# EAGLE schematic PCB_Vienna (EAGLE 9.5.1)
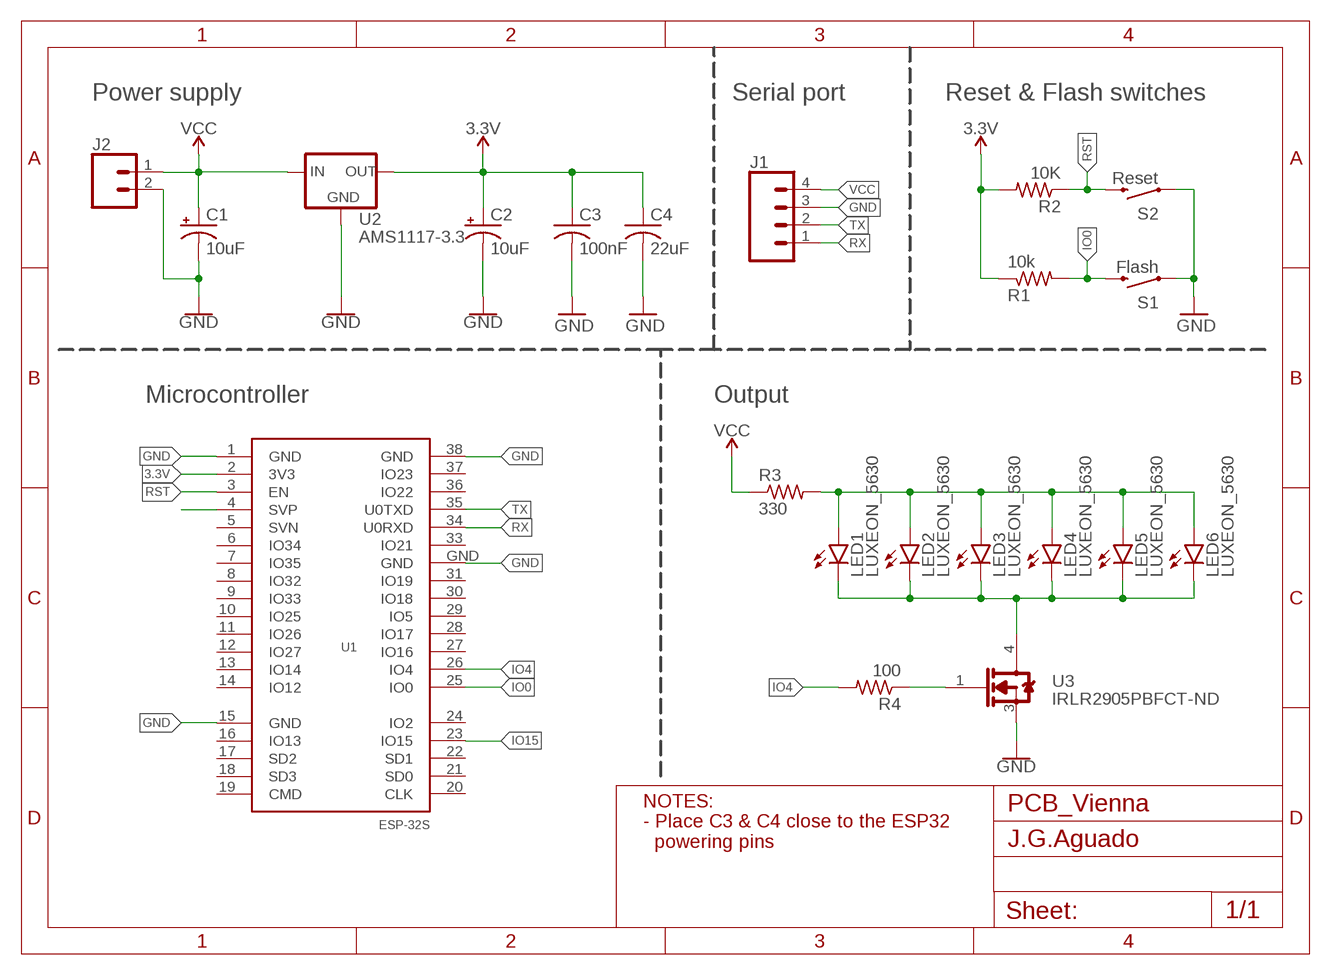
[diagram p0: schematic, sheet 1]

## Parts
C1  10uF  CPOL-USA/3216-18R  [A/3216-18R]
C2  10uF  CPOL-USA/3216-18R  [A/3216-18R]
C3  100nF  C-USC1206  [C1206]
C4  22uF  C-USC1206  [C1206]
J1  CONN_04SMD_RA_FEMALE  [1X04_SMD_RA_FEMALE]
J2  CONN_02-JST-2MM-SMT  [JST-2-SMD]
LED1  LUXEON_5630  [LUXEON_5630]
LED2  LUXEON_5630  [LUXEON_5630]
LED3  LUXEON_5630  [LUXEON_5630]
LED4  LUXEON_5630  [LUXEON_5630]
LED5  LUXEON_5630  [LUXEON_5630]
LED6  LUXEON_5630  [LUXEON_5630]
R1  10k  R-US_M1206  [M1206]
R2  10K  R-US_M1206  [M1206]
R3  330  R-US_M1206  [M1206]
R4  100  R-US_M1206  [M1206]
S1  Flash  SWITCH-MOMENTARY-2SMD-4  [TACTILE_SWITCH_TALL]
S2  Reset  SWITCH-MOMENTARY-2SMD-4  [TACTILE_SWITCH_TALL]
U1  ESP-32S  [ESP-32S]
U2  AMS1117-3.3  V_REG_LD1117VXXLD1117-SMD  [SOT223]
U3  IRLR2905TRPBF  INFINEON_TECHNOLOGIES_IRLR2905TRPBFINFINEON_TECHNOLOGIES_IRLR2905TRPBF_0_0  [INFINEON_TECHNOLOGIES_IRLR2905TRPBF_0]

## Nets
3.3V: C2.+ C3.1 C4.1 R1.1 R2.2 U1.2(3V3) U2.2(OUT)
GND: C1.- C2.- C3.2 C4.2 J1.3 J2.2 S1.A2 S2.A2 U1.1(GND) U1.15(GND) U1.38(GND) U1.GND U2.1(GND) U3.3(SOURCE)
IN_1: U1.4(SVP)
IO0: R1.2 S1.B2 U1.25(IO0)
IO4: R4.2 U1.26(IO4)
IO15: U1.23(IO15)
L+: LED1.2(A) LED2.2(A) LED3.2(A) LED4.2(A) LED5.2(A) LED6.2(A) R3.2
L-: LED1.1@1(C) LED1.1@2(C) LED2.1@1(C) LED2.1@2(C) LED3.1@1(C) LED3.1@2(C) LED4.1@1(C) LED4.1@2(C) LED5.1@1(C) LED5.1@2(C) LED6.1@1(C) LED6.1@2(C) U3.4(DRAIN)
N$4: R4.1 U3.1(GATE)
RST: R2.1 S2.B2 U1.3(EN)
RX: J1.1 U1.34(U0RXD)
TX: J1.2 U1.35(U0TXD)
VCC: C1.+ J1.4 J2.1 R3.1 U2.3(IN)
Unconnected: U1.5(SVN) U1.6(IO34) U1.7(IO35) U1.8(IO32) U1.9(IO33) U1.10(IO25) U1.11(IO26) U1.12(IO27) U1.13(IO14) U1.14(IO12) U1.16(IO13) U1.17(SD2) U1.18(SD3) U1.19(CMD) U1.20(CLK) U1.21(SD0) U1.22(SD1) U1.24(IO2) U1.27(IO16) U1.28(IO17) U1.29(IO5) U1.30(IO18) U1.31(IO19) U1.33(IO21) U1.36(IO22) U1.37(IO23)

## Notes on the sheet
- Power supply | Serial port | Reset & Flash switches
- Microcontroller | Output
- NOTES:
  - Place C3 & C4 close to the ESP32
    powering pins
- J.G.Aguado

## Library data of the parts
C1 C2 = rcl:CPOL-US: POLARIZED CAPACITOR, American symbol; LCSC: C7171; SPICEPREFIX: C
C3 C4 = rcl:C-US: CAPACITOR, American symbol; SPICEPREFIX: C
J1 = SparkFun-Connectors:CONN_04: Multi connection point. Often used as Generic Header-pin footprint for 0.1 inch spaced/style header connections On any of the 0.1 inch spaced packages, you can populate with these: Break Away Headers - Straight <https://www.sparkfun.com/products/116> (PRT-00116) Break Away Male Headers - Right Angle <https://www.sparkfun.com/products/553> (PRT-00553) Female Headers <https://www.sparkfun.com/products/115> (PRT-00115) Break Away Headers - Machine Pin <https://www.sparkfun.com/products/117> (PRT-00117) Break Away Female Headers - Swiss Machine Pin <https://www.sparkfun.com/products/743> (PRT-00743) For SCREWTERMINALS and SPRING TERMINALS visit here: Screw Terimnals on SparkFun.com <https://www.sparkfun.com/search/results?term=Screw+Terminals> (5mm/3.5mm/2.54mm spacing) This device is also useful as a general connection point to wire up your design to another part of your project. Our various solder wires solder well into these plated through hole pads. Hook-Up Wire - Assortment (Stranded, 22 AWG) <https://www.sparkfun.com/products/11375> (PRT-11375) Hook-Up Wire - Assortment (Solid Core, 22 AWG) <https://www.sparkfun.com/products/11367> (PRT-11367) View the entire wire category on our website here <https://www.sparkfun.com/categories/141> Special notes: Molex polarized connector foot print use with SKU : PRT-08231 with associated crimp pins and housings. 1MM SMD Version SKU: PRT-10208; PROD_ID: CONN-12382
J2 = SparkFun-Connectors:CONN_02: Multi connection point. Often used as Generic Header-pin footprint for 0.1 inch spaced/style header connections On any of the 0.1 inch spaced packages, you can populate with these: Break Away Headers - Straight <https://www.sparkfun.com/products/116> (PRT-00116) Break Away Male Headers - Right Angle <https://www.sparkfun.com/products/553> (PRT-00553) Female Headers <https://www.sparkfun.com/products/115> (PRT-00115) Break Away Headers - Machine Pin <https://www.sparkfun.com/products/117> (PRT-00117) Break Away Female Headers - Swiss Machine Pin <https://www.sparkfun.com/products/743> (PRT-00743) For SCREWTERMINALS and SPRING TERMINALS visit here: Screw Terimnals on SparkFun.com <https://www.sparkfun.com/search/results?term=Screw+Terminals> (5mm/3.5mm/2.54mm spacing) This device is also useful as a general connection point to wire up your design to another part of your project. Our various solder wires solder well into these plated through hole pads. Hook-Up Wire - Assortment (Stranded, 22 AWG) <https://www.sparkfun.com/products/11375> (PRT-11375) Hook-Up Wire - Assortment (Solid Core, 22 AWG) <https://www.sparkfun.com/products/11367> (PRT-11367) View the entire wire category on our website here <https://www.sparkfun.com/categories/141> Special notes: Molex polarized connector foot print use with: PRT-08233 with associated crimp pins and housings. 2.54_SCREWTERM for use with PRT-10571. 3.5mm Screw Terminal footprints for PRT-08084 5mm Screw Terminal footprints for use with PRT-08432; PROD_ID: CONN-11443
LED1-LED6 = led:LUXEON_5630: LUXEON 5630 Mid-Power LEDs SD201 Source: Data sheet <www.philipslumileds.com/uploads/351/DS201-pdf> Lumileds 5630 Datasheet DS201 20130228 ©2013 Philips Lumileds Lighting Company.
R1-R4 = rcl:R-US_: RESISTOR, American symbol; SPICEPREFIX: R
S1 S2 = Testing:SWITCH-MOMENTARY-2: Various NO switches- pushbuttons, reed, etc
U1 = esp32:ESP-32S: Ai-Thinker ESP-32S
U2 = SparkFun-IC-Power:V_REG_LD1117VXX: LD1117VXX voltage regulator. We carry the 3.3V version (COM-00526) in TO-220 package.; PROD_ID: VREG-13917
U3 = Infineon Technologies - IRLR2905TRPBF:INFINEON_TECHNOLOGIES_IRLR2905TRPBF: MOSFET N-CH 55V 42A DPAK; AUTOMOTIVE: No; CENTROID_NOT_SPECIFIED: Yes; CONTINUOUS_DRAIN_CURRENT: 42A; DATASHEET: https://www.infineon.com/dgdl/irlr2905pbf.pdf?fileId=5546d462533600a40153566cc2bb2679; DEPLETION_MODE: False; DEVICE_CLASS_L1: Discrete Semiconductors; DEVICE_CLASS_L2: Transistors; DEVICE_CLASS_L3: MOSFETs; DIGIKEY_DESCRIPTION: TRANS MOSFET N-CH 55V 42A DPAK; DIGIKEY_PART_NUMBER: IRLR2905PBFCT-ND; DRAIN_TO_SOURCE_BREAKDOWN_VOLTAGE: 55V; DRAIN_TO_SOURCE_RESISTANCE: 0.03Ω; DRAIN_TO_SOURCE_VOLTAGE: 55V; FOOTPRINT_URL: http://www.irf.com/package/hexfet/dpakfootprint.pdf; FOOTPRINT_VARIANT_NAME_0: Recommended_Land_Pattern; GATE_CHARGE_AT_VGS: 48nC @ 5V; GATE_TO_SOURCE_VOLTAGE: 16V; HEIGHT: 2.52mm; INPUT_CAPACITACE_AT_VDS: 1700pF @ 25V; LEAD_FREE: Yes; MAX_FORWARD_DIODE_VOLTAGE: 1.3V; MAX_JUNCTION_TEMP: +175°C; MF: Infineon Technologies; MFG_PACKAGE_IDENT: PG-TO252-3; MFG_PACKAGE_IDENT_DATE: 0; MFG_PACKAGE_IDENT_REV: 901; MOUSER_PART_NUMBER: 942-IRLR2905TRPBF; MPN: IRLR2905TRPBF; NUMBER_OF_CHANNELS: 1; NUMBER_OF_N_CHANNELS: 1; PACKAGE: D-Pak; POWER_DISSIPATION: 110W; PREFIX: Q; PULSE_DRAIN_CURRENT: 160A; REVERSE_RECOVERY_CHARGE: 210nC; REVERSE_RECOVERY_TIME: 80ns; ROHS: Yes; RTHJA_MAX: 110°C/W; TEMPERATURE_RANGE_HIGH: +175°C; TEMPERATURE_RANGE_LOW: -55°C; THRESHOLD_VGS_MAX: 2V; THRESHOLD_VGS_MIN: 1V; TURN_OFF_DELAY_TIME: 26ns; TURN_ON_DELAY_TIME: 11ns; VERIFICATION_VERSION: 0.0.0.3

## Net classes
0 default: clearance 0.205 mm
2 analog: width 0.203 mm, drill 0.33 mm, clearance 0.152 mm